# EAGLE design StaticPlatformADC_v1 (EAGLE 9.6.2)
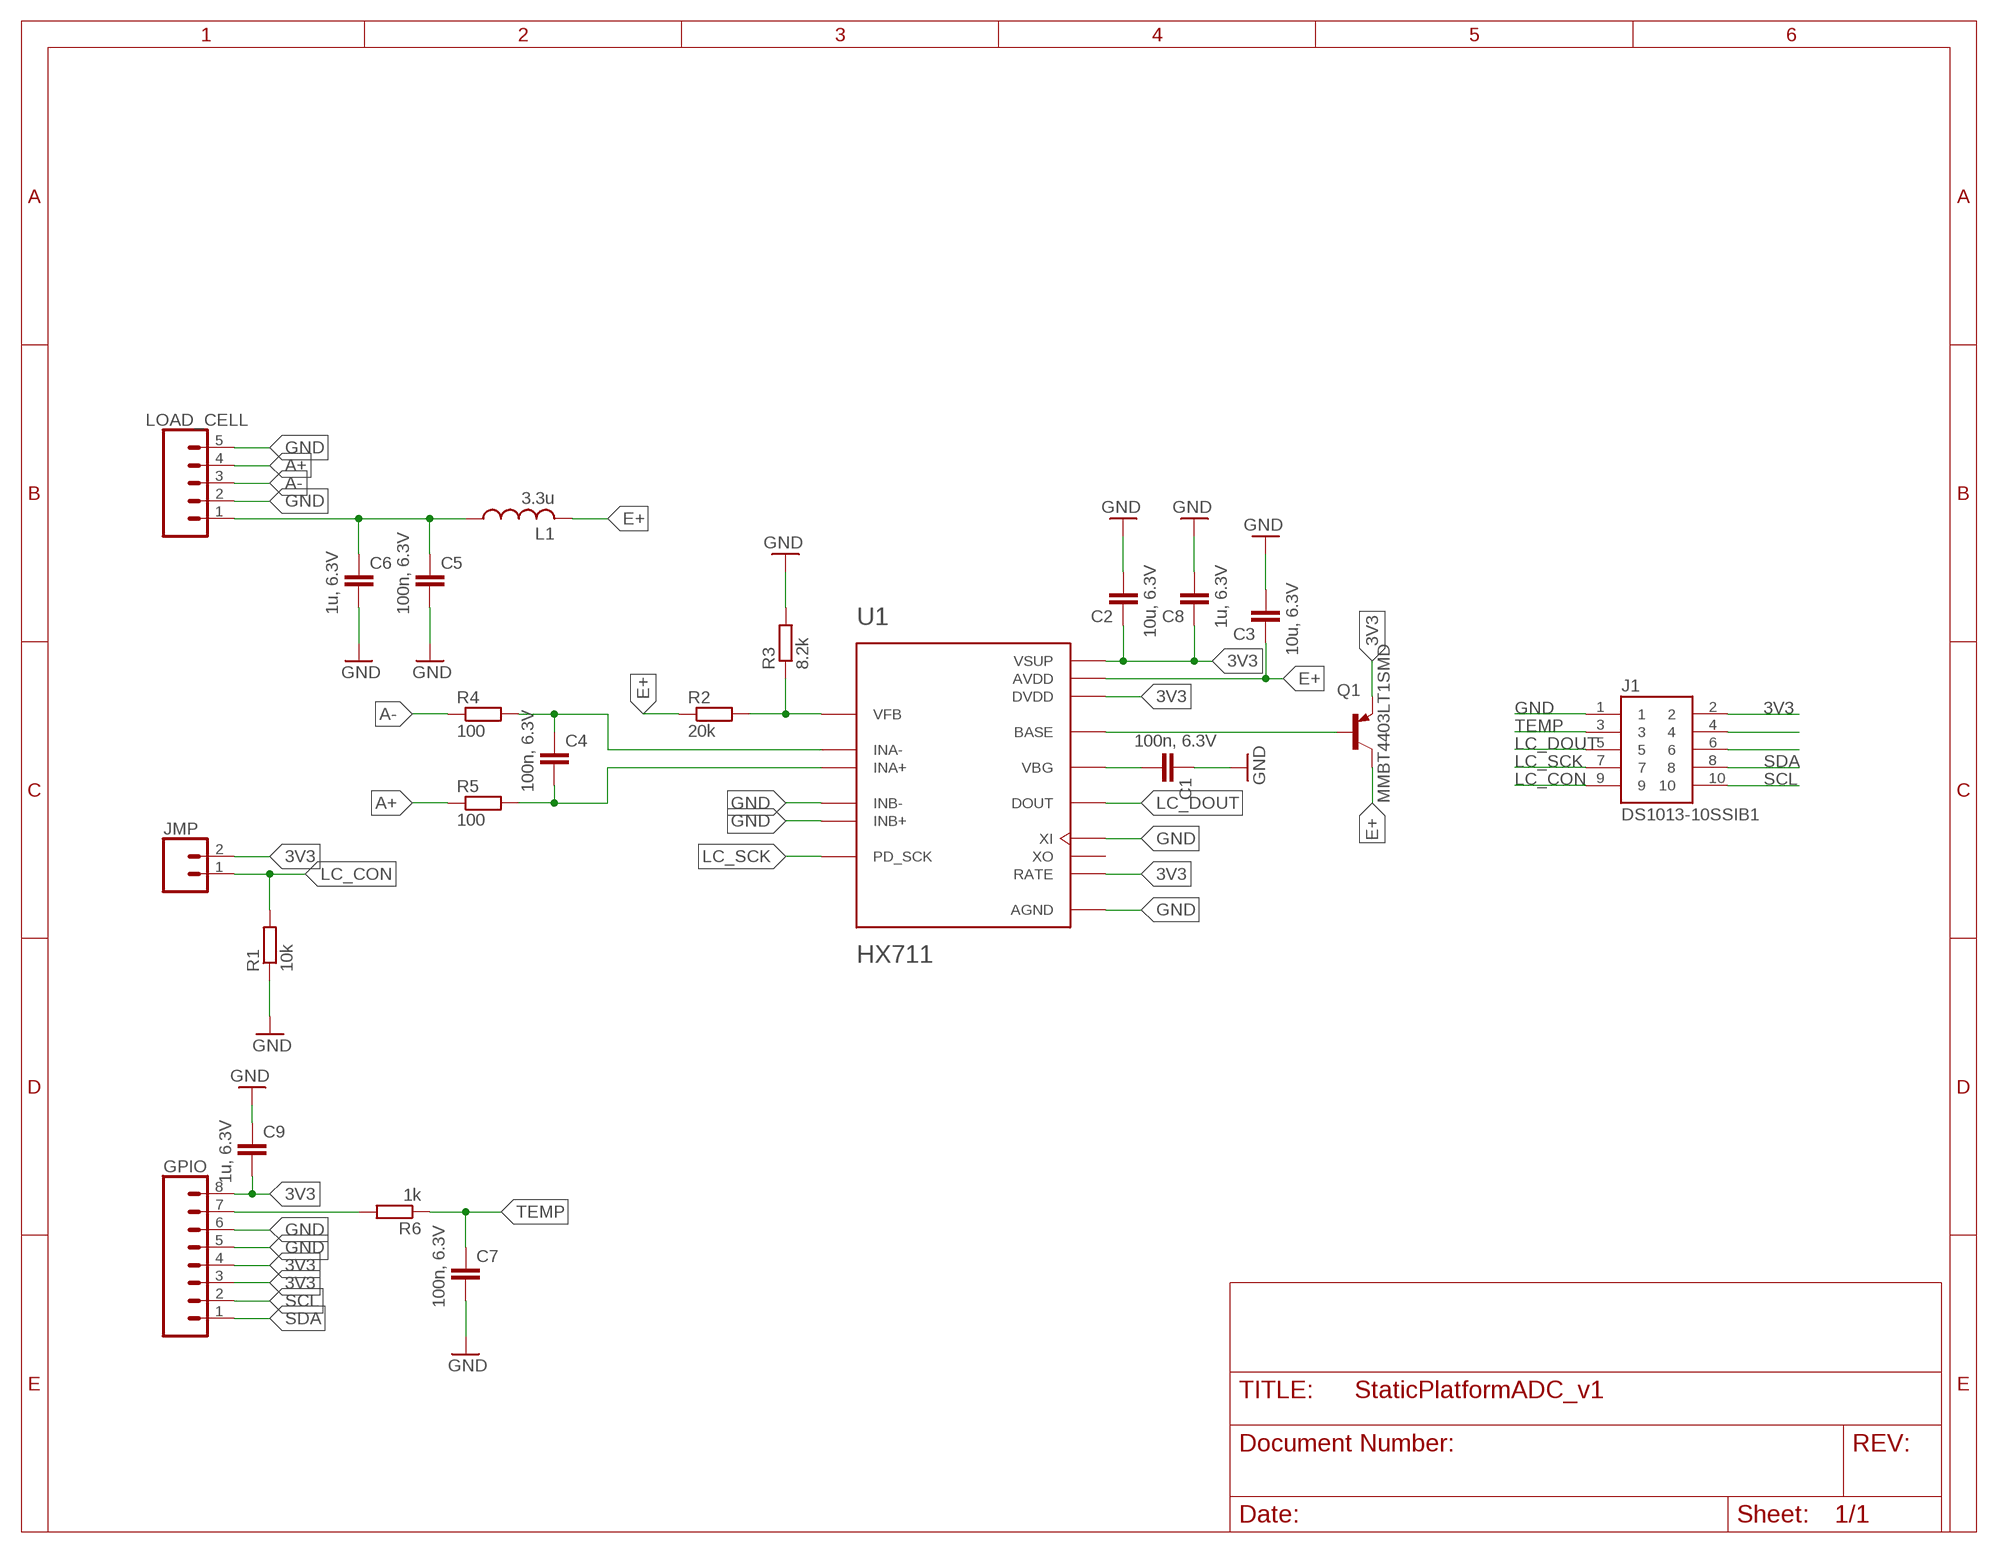
[diagram p0: schematic, sheet 1]

## Parts
C1  100n, 6.3V  C-EUC0805  [C0805]
C2  10u, 6.3V  C-EUC0805  [C0805]
C3  10u, 6.3V  C-EUC0805  [C0805]
C4  100n, 6.3V  C-EUC0805  [C0805]
C5  100n, 6.3V  C-EUC0805  [C0805]
C6  1u, 6.3V  C-EUC0805  [C0805]
C7  100n, 6.3V  C-EUC0805  [C0805]
C8  1u, 6.3V  C-EUC0805  [C0805]
C9  1u, 6.3V  C-EUC0805  [C0805]
GPIO  CONN_08NO_SILK_FEMALE_PTH  [1X08_NO_SILK]
J1  DS1013-10SSIB1  [CONNFLY_DS1013-10SSIB1]
JMP  CONN_021X02_NO_SILK  [1X02_NO_SILK]
L1  3.3u  L-USL3225P  [L3225P]
LOAD_CELL  CONN_05NO_SILK  [1X05_NO_SILK]
Q1  MMBT4403LT1SMD  [SOT23-BEC]
R1  10k  R-EU_R0805  [R0805]
R2  20k  R-EU_R0805  [R0805]
R3  8.2k  R-EU_R0805  [R0805]
R4  100  R-EU_R0805  [R0805]
R5  100  R-EU_R0805  [R0805]
R6  1k  R-EU_R0805  [R0805]
U1  HX711  [SOP127P600X180-16N]

## Nets
3V3: C2.1 C8.1 C9.2 GPIO.3 GPIO.4 GPIO.8 J1.2 JMP.2 Q1.E U1.1(VSUP) U1.15(RATE) U1.16(DVDD)
A+: LOAD_CELL.4 R5.1
A-: LOAD_CELL.3 R4.1
E+: C3.1 L1.2 Q1.C R2.1 U1.3(AVDD)
GND: C1.1 C2.2 C3.2 C5.2 C6.2 C7.2 C8.2 C9.1 GPIO.5 GPIO.6 J1.1 LOAD_CELL.2 LOAD_CELL.5 R1.1 R3.2 U1.5(AGND) U1.9(INB-) U1.10(INB+) U1.14(XI)
LC_CON: J1.9 JMP.1 R1.2
LC_DOUT: J1.5 U1.12(DOUT)
LC_SCK: J1.7 U1.11(PD_SCK)
N$3: C5.1 C6.1 L1.1 LOAD_CELL.1
N$4: Q1.B U1.2(BASE)
N$5: R2.2 R3.1 U1.4(VFB)
N$7: C1.2 U1.6(VBG)
N$8: J1.4
N$10: GPIO.7 R6.2
N$12: C4.1 R4.2 U1.7(INA-)
N$13: C4.2 R5.2 U1.8(INA+)
N$16: J1.6
SCL: GPIO.2 J1.10
SDA: GPIO.1 J1.8
TEMP: C7.1 J1.3 R6.1
Unconnected: U1.13(XO)

## Library data of the parts
C1-C9 = rcl:C-EU: CAPACITOR, European symbol; SPICEPREFIX: C
GPIO = SparkFun-Connectors:CONN_08: Multi connection point. Often used as Generic Header-pin footprint for 0.1 inch spaced/style header connections On any of the 0.1 inch spaced packages, you can populate with these: Break Away Headers - Straight <https://www.sparkfun.com/products/116> (PRT-00116) Break Away Male Headers - Right Angle <https://www.sparkfun.com/products/553> (PRT-00553) Female Headers <https://www.sparkfun.com/products/115> (PRT-00115) Break Away Headers - Machine Pin <https://www.sparkfun.com/products/117> (PRT-00117) Break Away Female Headers - Swiss Machine Pin <https://www.sparkfun.com/products/743> (PRT-00743) Arduino Stackable Header - 8 Pin <https://www.sparkfun.com/products/9279> (PRT-09279) For SCREWTERMINALS and SPRING TERMINALS visit here: Screw Terimnals on SparkFun.com <https://www.sparkfun.com/search/results?term=Screw+Terminals> (5mm/3.5mm/2.54mm spacing) This device is also useful as a general connection point to wire up your design to another part of your project. Our various solder wires solder well into these plated through hole pads. Hook-Up Wire - Assortment (Stranded, 22 AWG) <https://www.sparkfun.com/products/11375> (PRT-11375) Hook-Up Wire - Assortment (Solid Core, 22 AWG) <https://www.sparkfun.com/products/11367> (PRT-11367) View the entire wire category on our website here <https://www.sparkfun.com/categories/141> Special notes: Molex polarized connector foot print use with SKU : PRT-08231 with associated crimp pins and housings. 1MM SMD Version SKU: PRT-10208 NOTES ON THE VARIANTS LOCK and LOCK_LONGPADS... This footprint was designed to help hold the alignment of a through-hole component (i.e. 6-pin header) while soldering it into place. You may notice that each hole has been shifted either up or down by 0.005 of an inch from it's more standard position (which is a perfectly straight line). This slight alteration caused the pins (the squares in the middle) to touch the edges of the holes. Because they are alternating, it causes a "brace" to hold the component in place. 0.005 has proven to be the perfect amount of "off-center" position when using our standard breakaway headers. Although looks a little odd when you look at the bare footprint, once you have a header in there, the alteration is very hard to notice. Also,if you push a header all the way into place, it is covered up entirely on the bottom side.; PROD_ID: CONN-08438
J1 = IDC_CON_DS1013-10SSIB1:DS1013-10SSIB1: Socket; IDC; male; PIN: 10; straight; THT; gold-plated; 2.54mm Check availability <https://pricing.snapeda.com/parts/DS1013-10SSIB1/Connfly/view-part?ref=eda>; AVAILABILITY: Not in stock; DESCRIPTION: Socket; IDC; male; PIN: 10; straight; THT; gold plated; 2.54mm; MF: Connfly; MP: DS1013-10SSIB1; PACKAGE: None; PRICE: None
JMP = SparkFun-Connectors:CONN_02: Multi connection point. Often used as Generic Header-pin footprint for 0.1 inch spaced/style header connections On any of the 0.1 inch spaced packages, you can populate with these: Break Away Headers - Straight <https://www.sparkfun.com/products/116> (PRT-00116) Break Away Male Headers - Right Angle <https://www.sparkfun.com/products/553> (PRT-00553) Female Headers <https://www.sparkfun.com/products/115> (PRT-00115) Break Away Headers - Machine Pin <https://www.sparkfun.com/products/117> (PRT-00117) Break Away Female Headers - Swiss Machine Pin <https://www.sparkfun.com/products/743> (PRT-00743) For SCREWTERMINALS and SPRING TERMINALS visit here: Screw Terimnals on SparkFun.com <https://www.sparkfun.com/search/results?term=Screw+Terminals> (5mm/3.5mm/2.54mm spacing) This device is also useful as a general connection point to wire up your design to another part of your project. Our various solder wires solder well into these plated through hole pads. Hook-Up Wire - Assortment (Stranded, 22 AWG) <https://www.sparkfun.com/products/11375> (PRT-11375) Hook-Up Wire - Assortment (Solid Core, 22 AWG) <https://www.sparkfun.com/products/11367> (PRT-11367) View the entire wire category on our website here <https://www.sparkfun.com/categories/141> Special notes: Molex polarized connector foot print use with: PRT-08233 with associated crimp pins and housings. 2.54_SCREWTERM for use with PRT-10571. 3.5mm Screw Terminal footprints for PRT-08084 5mm Screw Terminal footprints for use with PRT-08432
L1 = rcl:L-US: INDUCTOR, American symbol; SPICEPREFIX: L
LOAD_CELL = SparkFun-Connectors:CONN_05: Multi connection point. Often used as Generic Header-pin footprint for 0.1 inch spaced/style header connections On any of the 0.1 inch spaced packages, you can populate with these: Break Away Headers - Straight <https://www.sparkfun.com/products/116> (PRT-00116) Break Away Male Headers - Right Angle <https://www.sparkfun.com/products/553> (PRT-00553) Female Headers <https://www.sparkfun.com/products/115> (PRT-00115) Break Away Headers - Machine Pin <https://www.sparkfun.com/products/117> (PRT-00117) Break Away Female Headers - Swiss Machine Pin <https://www.sparkfun.com/products/743> (PRT-00743) For SCREWTERMINALS and SPRING TERMINALS visit here: Screw Terimnals on SparkFun.com <https://www.sparkfun.com/search/results?term=Screw+Terminals> (5mm/3.5mm/2.54mm spacing) This device is also useful as a general connection point to wire up your design to another part of your project. Our various solder wires solder well into these plated through hole pads. Hook-Up Wire - Assortment (Stranded, 22 AWG) <https://www.sparkfun.com/products/11375> (PRT-11375) Hook-Up Wire - Assortment (Solid Core, 22 AWG) <https://www.sparkfun.com/products/11367> (PRT-11367) View the entire wire category on our website here <https://www.sparkfun.com/categories/141> Special notes: Molex polarized connector foot print use with SKU : PRT-08231 with associated crimp pins and housings. 1MM SMD Version SKU: PRT-10208
Q1 = transistor-pnp:MMBT4403*: PNP Transistror
R1-R6 = rcl:R-EU_: RESISTOR, European symbol; SPICEPREFIX: R
U1 = HX711:HX711: Check availability <https://pricing.snapeda.com/parts/HX711/AVIA%20SEMICONDUCTOR/view-part?ref=eda>; AVAILABILITY: Not in stock; DESCRIPTION: Precision 24-bit analog-to-digital converter (ADC) designed for weigh scales and industrial control applications to interface directly with a bridge sensor.; MF: AVIA SEMICONDUCTOR; MP: HX711; PACKAGE: None; PRICE: None

## Board
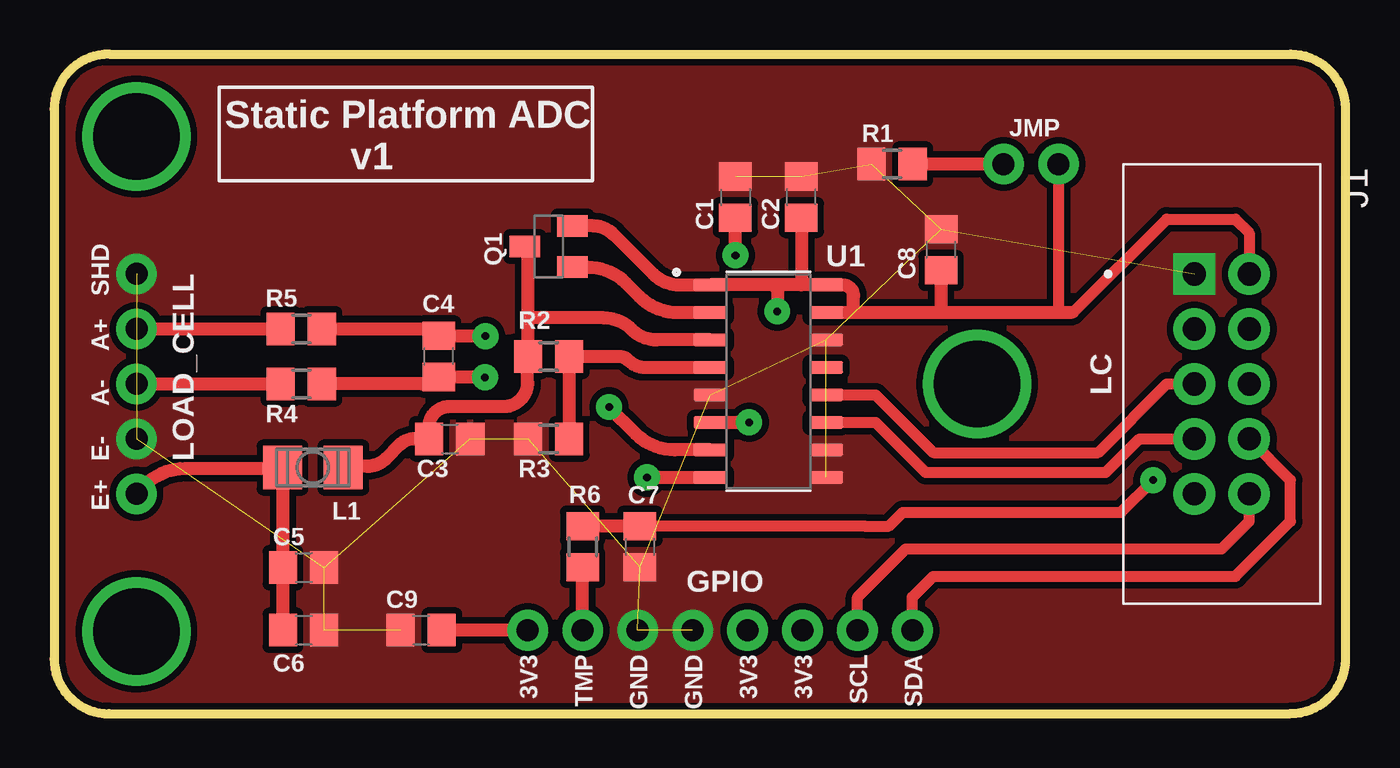
[diagram p1: board, top side]
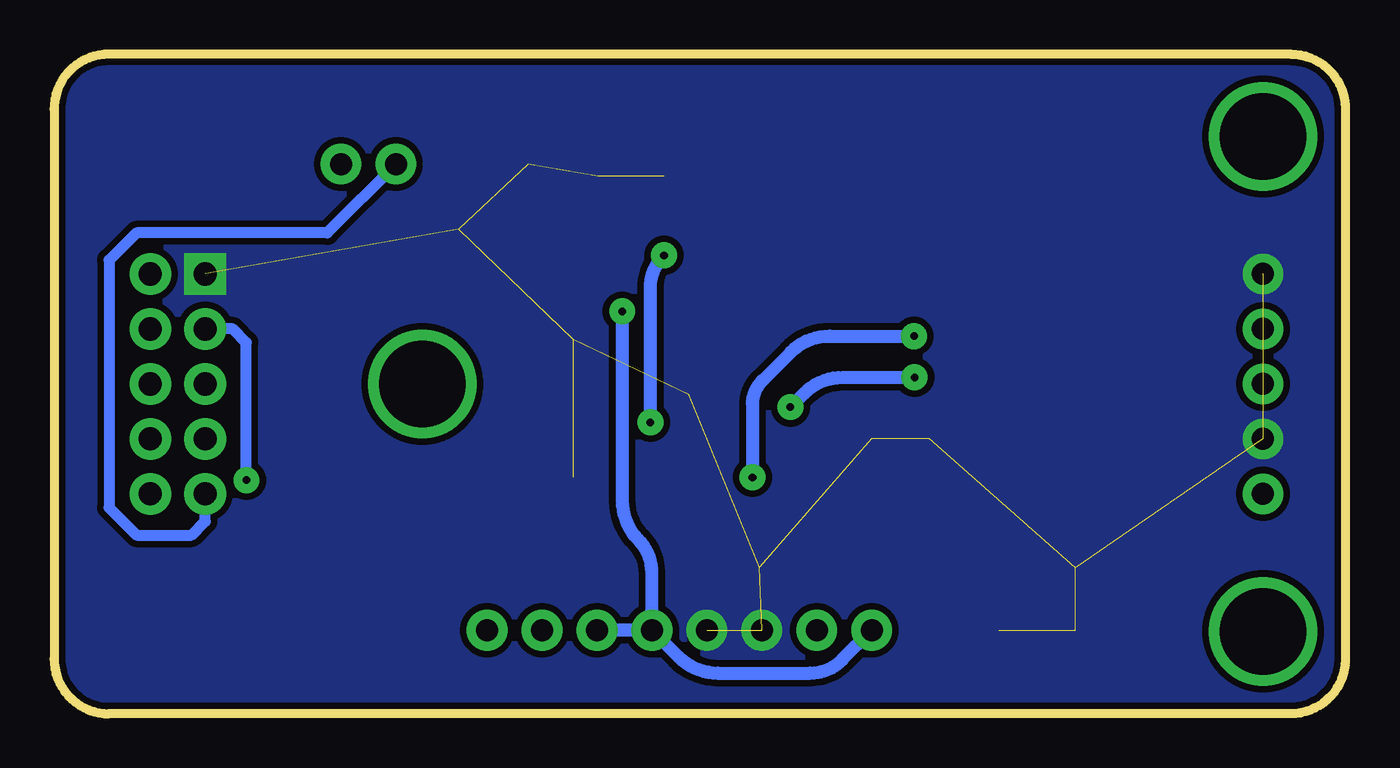
[diagram p2: board, bottom side, seen from below]

Size 59.69 x 30.48 mm. Coordinates in mm from the lower left corner, seen from the top.
Outline: 0,27.94 0,2.54 arc90 2.54,0 57.15,0 arc90 59.69,2.54 59.69,27.94 arc90 57.15,30.48 2.54,30.48 arc90 0,27.94
Copper layers (1*16): Top 0.035mm / dielectric 1.5mm / Bottom 0.035mm
Design rules "default *": minimum track width 0.25mm, minimum drill 0.35mm, track to track 0.2mm, track to pad 0.2mm, pad to pad 0.2mm, via to via 0.2mm, smd to smd 0.2mm, copper to edge 5mil, drill to drill 6mil, minimum pad ring 0.425mm, minimum via ring 0.425mm, stop-mask expansion 4mil, vias tented up to drill 0mil, thermal gap 0mil

### Footprints (pad centres in the part's own frame; a part is rotated, then mirrored left to right if it is on the bottom)
C0805 = smd 1.3 x 1.5: 1 -0.95,0; 2 0.95,0
1X08_NO_SILK = drill 1.016 pad 1.88: 1 0,0; 2 2.54,0; 3 5.08,0; 4 7.62,0; 5 10.16,0; 6 12.7,0; 7 15.24,0; 8 17.78,0
CONNFLY_DS1013-10SSIB1 = drill 1.07 square: 1 -5.08,-1.27 | drill 1.07: 2 -5.08,1.27; 3 -2.54,-1.27; 4 -2.54,1.27; 5 0,-1.27; 6 0,1.27; 7 2.54,-1.27; 8 2.54,1.27; 9 5.08,-1.27; 10 5.08,1.27
1X02_NO_SILK = drill 1.016 pad 1.88: 1 0,0; 2 2.54,0
L3225P = smd 1.8 x 2: 1 -1.4,0; 2 1.4,0
1X05_NO_SILK = drill 1.016 pad 1.88: 1 0,0; 2 2.54,0; 3 5.08,0; 4 7.62,0; 5 10.16,0
SOT23-BEC = smd 1 x 1.4: B -0.95,-1.1; C 0,1.1; E 0.95,-1.1
R0805 = smd 1.3 x 1.5: 1 -0.95,0; 2 0.95,0
SOP127P600X180-16N = smd 1.58 x 0.59: 1 -2.67,4.445; 2 -2.67,3.175; 3 -2.67,1.905; 4 -2.67,0.635; 5 -2.67,-0.635; 6 -2.67,-1.905; 7 -2.67,-3.175; 8 -2.67,-4.445; 9 2.67,-4.445; 10 2.67,-3.175; 11 2.67,-1.905; 12 2.67,-0.635; 13 2.67,0.635; 14 2.67,1.905; 15 2.67,3.175; 16 2.67,4.445

### Placement (x,y rotation side)
C1  31.5,23.88 270 top
C2  34.54,23.88 90 top
C3  18.29,12.7 0 top
C4  17.78,16.51 90 top
C5  11.53,6.76 0 top
C6  11.53,3.86 0 top
C7  27.08,7.72 270 top
C8  41,21.44 90 top
C9  16.97,3.86 0 top
GPIO  39.67,3.86 180 top
J1  53.98,15.24 270 top
JMP  43.89,25.4 0 top
L1  11.96,11.38 0 top
LOAD_CELL  3.81,10.16 90 top
Q1  22.86,21.59 90 top
R1  38.73,25.4 0 top
R2  22.86,16.51 0 top
R3  22.86,12.7 180 top
R4  11.43,15.24 0 top
R5  11.43,17.78 0 top
R6  24.43,7.72 270 top
U1  33.02,15.37 0 top

### Tracks (layer width: path | path; a pad name or v marks a point on that pad's centre or on a via)
3V3  (via drill 0.35)
  Top 0.406: 38.02,18.52 arc-90 38.05,18.54
  Top 0.508: 47.02,18.54 47.12,18.54 51.44,22.86 54.61,22.86 55.25,22.22 J1.2 | JMP.2 46.43,18.62 46.36,18.54
  Top 0.61: 34.65,22.68 arc45 C2.1 34.54,19.81 | 36.96,18.54 36.96,19.3 arc90 36.45,19.81 U1.16 34.54,19.81 | 36.96,18.54 38.05,18.54 41,18.54 | U1.15 36.96,18.54 | 34.54,19.81 33.53,19.81 | 33.53,19.81 U1.1 28.91,19.81 arc-45 27.69,20.32 25.85,22.15 arc45 24.92,22.54 Q1.E | 41,18.54 46.36,18.54 47.02,18.54 | C8.1 41,18.54 | 33.53,19.81 arc45 33.43,19.57 v33.43,18.59 | GPIO.8 C9.2
  Bottom 0.61: v33.43,18.59 33.43,9.84 arc-45 32.68,8.04 arc45 32.05,6.53 GPIO.4 | GPIO.4 GPIO.3 | GPIO.4 30.82,2.62 arc-45 29.02,1.88 24.74,1.88 arc-45 23.27,2.49 GPIO.8
A+
  Top 0.61: LOAD_CELL.4 R5.1
A-
  Top 0.61: LOAD_CELL.3 R4.1
E+
  Top 0.61: 21.91,18.29 R2.1 arc90 21.9,16.5 21.9,15.32 arc-90 20.78,14.2 18.26,14.2 arc90 17.34,13.27 C3.1 16.62,12.7 arc45 16,12.45 15.35,11.79 arc-45 14.48,11.43 13.49,11.43 arc45 L1.2 | 21.91,18.29 21.91,21.23 arc45 Q1.C | U1.3 27.86,17.27 arc-45 26.7,17.75 arc45 25.41,18.29 21.91,18.29
GND  (18 unrouted)
  pour Top (isolate 0.305): -1.27,31.75 60.96,31.75 60.96,-1.27 -1.27,-1.27
  pour Bottom (isolate 0.305): -1.27,31.75 60.96,31.75 60.96,-1.27 -1.27,-1.27
LC_CON
  Top 0.61: JMP.1 R1.2
  Bottom 0.508: J1.9 52.7,8.89 53.34,8.25 55.88,8.25 57.15,9.53 57.15,20.95 55.88,22.22 47.07,22.22 JMP.1
LC_DOUT
  Top 0.508: U1.12 37.97,14.73 40.64,12.07 48.26,12.07 51.44,15.24 J1.5
LC_SCK
  Top 0.508: U1.11 37.97,13.46 40.28,11.15 48.62,11.15 50.16,12.7 J1.7
N$1  (via drill 4)
  other vias: 3.81,26.67
N$2  (via drill 4)
  other vias: 3.81,3.81
N$3
  Top 0.61: 10.58,11.34 C5.1 C6.1 | 10.58,11.34 arc45 L1.1 | LOAD_CELL.1 4.24,10.59 arc-45 6.04,11.34 10.58,11.34
N$4
  Top 0.61: Q1.B 24.64,20.64 arc-45 26.43,19.9 27.04,19.29 arc45 28.84,18.54 U1.2
N$5
  Top 0.61: R3.1 R2.2 26.11,16.51 arc-45 26.54,16.33 arc45 27.34,16 U1.4
N$6  (via drill 4)
  other vias: 42.67,15.24
N$7  (via drill 0.35)
  Top 0.61: U1.6 v32.13,13.46 | v31.5,21.18 C1.2
  Bottom 0.61: v32.13,13.46 32.13,19.65 arc45 v31.5,21.18
N$10
  Top 0.61: GPIO.7 R6.2
N$12  (via drill 0.35)
  Top 0.61: C4.1 arc-45 17.01,15.24 R4.2 | U1.7 28.69,12.19 arc-45 26.89,12.94 v25.65,14.17 | 17.8,15.57 arc45 C4.1 | v19.91,15.55 17.82,15.55 arc-45 C4.1
  Bottom 0.61: v25.65,14.17 25.03,14.8 arc45 23.23,15.55 v19.91,15.55
N$13  (via drill 0.35)
  Top 0.61: R5.2 17.01,17.78 arc-45 C4.2 arc45 17.8,17.45 v19.94,17.45 | v27.41,10.92 U1.8
  Bottom 0.61: v27.41,10.92 27.41,14.29 arc45 26.95,15.39 25.64,16.71 arc45 23.84,17.45 v19.94,17.45
SCL
  Top 0.508: J1.10 55.25,8.89 53.98,7.62 39.37,7.62 37.14,5.38 GPIO.2
SDA
  Top 0.508: J1.8 57.15,10.8 57.15,8.89 54.61,6.35 40.64,6.35 39.68,5.38 GPIO.1
TEMP  (via drill 0.35)
  Top 0.508: v50.8,10.8 49.31,9.31 39.23,9.31 38.59,8.67 37.47,8.67 C7.1
  Top 0.61: C7.1 R6.1
  Bottom 0.508: v50.8,10.8 50.8,17.14 51.44,17.78 J1.3

### Text on the board
tNames: Static Platform ADC / v1 | SHD | A+ | A- | LC | E- | E+ | 3V3 | TMP | GND | GND | 3V3 | 3V3 | SCL | SDA